# Altium schematic sheet POWER.SchDoc
size A3; SheetNumber: 3; SheetTotal: 7
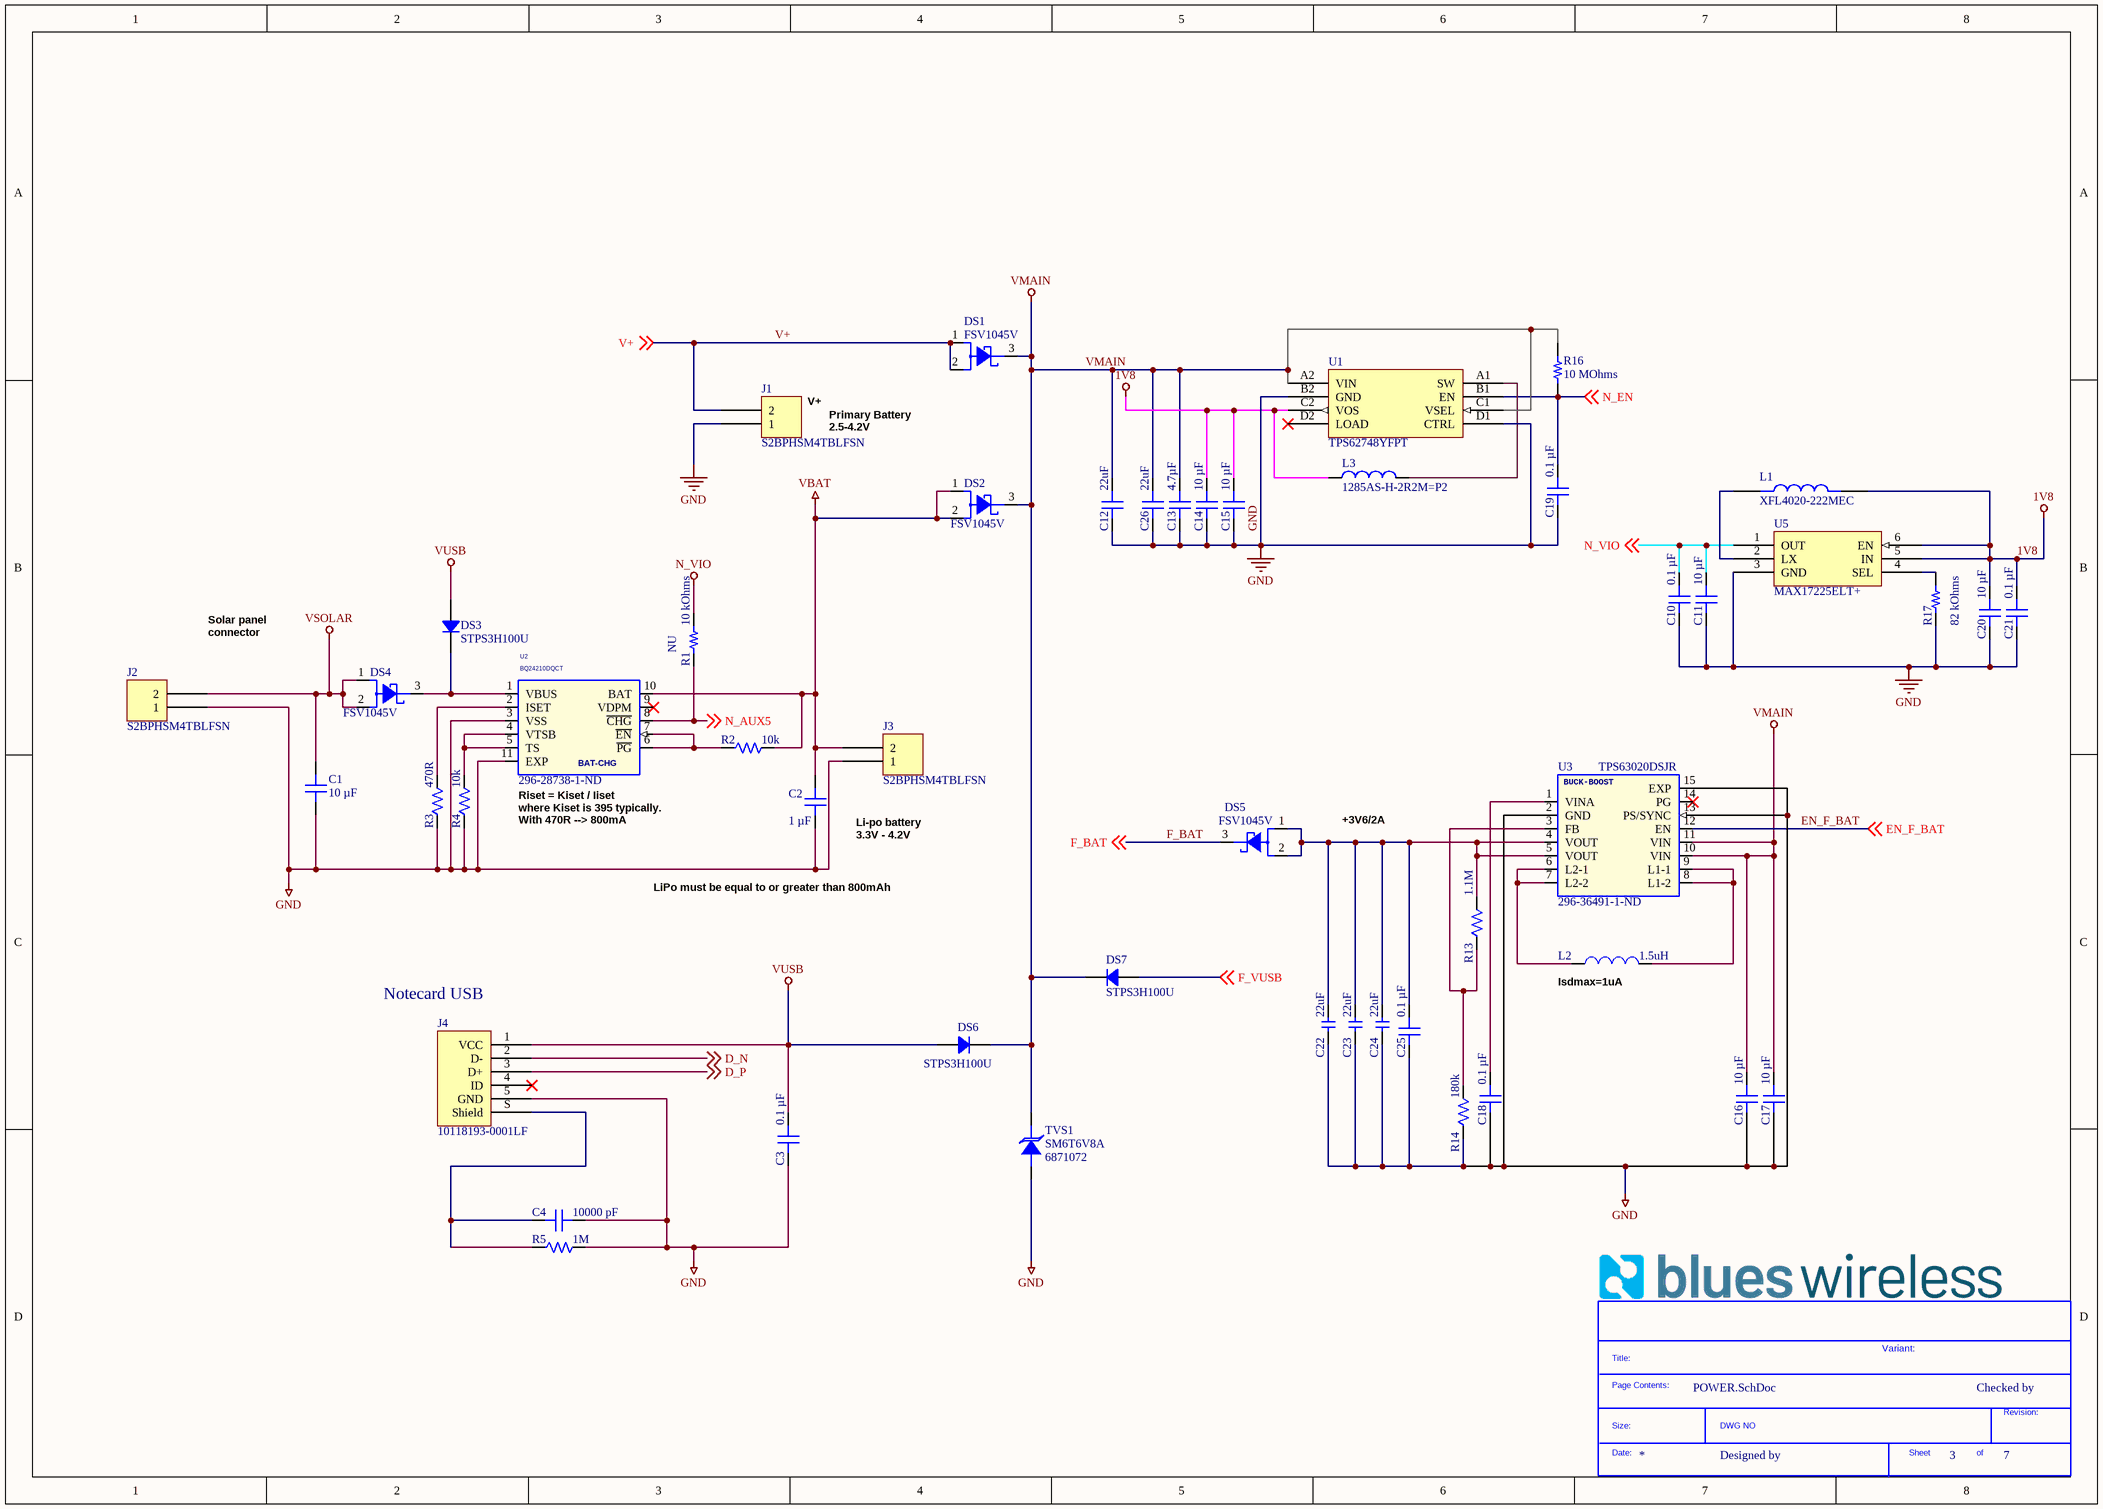
[diagram p0: POWER.SchDoc]

## Parts
*?  SDTitleBlock  (value not drawn)  (graphical)
C1  10 µF  [CAP 1206_3216 - 0.8MM]
C2  1 µF  [CAP 0402_1005]
C3  0.1 µF  [CAP 0402_1005]
C4  10000 pF  [CAP 1206_3216 - 0.8MM]
C10  0.1 µF  [CAP 0402_1005]
C11  10 µF  [CAP 0402_1005]
C12  22uF  [CAP 0805_2012]
C13  4.7µF  [CAP 0603_1608]
C14  10 µF  [CAP 0402_1005]
C15  10 µF  [CAP 0402_1005]
C16  10 µF  [CAP 0603_1608]
C17  10 µF  [CAP 0603_1608]
C18  0.1 µF  [CAP 0402_1005]
C19  0.1 µF  [CAP 0402_1005]
C20  10 µF  [CAP 0402_1005]
C21  0.1 µF  [CAP 0402_1005]
C22  22uF  [CAP FILM 0805]
C23  22uF  [CAP FILM 0805]
C24  22uF  [CAP FILM 0805]
C25  0.1 µF  [CAP 0402_1005]
C26  22uF  [CAP 0805_2012]
DS1  FSV1045V  [TO277-3]
DS2  FSV1045V  [TO277-3]
DS3  STPS3H100U  [DO214AA SMB]
DS4  FSV1045V  [TO277-3]
DS5  FSV1045V  [TO277-3]
DS6  STPS3H100U  [DO214AA SMB]
DS7  STPS3H100U  [DO214AA SMB]
J1  S2BPHSM4TBLFSN  [JST S2B-PH-SM4-TB]
J2  S2BPHSM4TBLFSN  [JST S2B-PH-SM4-TB]
J3  S2BPHSM4TBLFSN  [JST S2B-PH-SM4-TB]
J4  10118193-0001LF  [FCI USB 10118193-0001LF]
L1  XFL4020-222MEC  [IND_XFL4020-222MEC]
L2  1.5uH  [VCHA042A-1R5MS6]
L3  1285AS-H-2R2M=P2  [1285AS-H-2R2M=P2-INDC2016X100N]
R1  10 kOhms  [RES 0402_1005]  (no BOM)
R2  10k  [RES 0402_1005]
R3  470R  [RES 0402_1005]
R4  10k  [RES 0402_1005]
R5  1M  [RES 1206_3216]
R13  1.1M  [RES 0402_1005]
R14  180k  [RES 0402_1005]
R16  10 MOhms  [RES 0402_1005]
R17  82 kOhms  [RES 0402_1005]
TVS1  SM6T6V8A  Supplier Part Number 1: 6871072  [SMB]
U1  TPS62748YFPT  [TPS62748YFPT-DSBGA4x2]
U2  BQ24210DQCT  Supplier Part Number 1: 296-28738-1-ND  [WSON10-EXP]
U3  TPS63020DSJR  Supplier Part Number 1: 296-36491-1-ND  [TI PVSON-14 DSJ]
U5  MAX17225ELT+  [MAX17225ELT+UDFN]

## Nets
1V8: C14.2 C15.2 C20.2 C21.1 L1.2 L3.1 U1.C2(VOS) U5.5(IN) U5.6(EN)
GND: C1.2 C2.1 C3.2 C4.2 C10.2 C11.1 C12.1 C13.1 C14.1 C15.1 C16.1 C17.1 C18.1 C19.2 C20.1 C21.2 C22.2 C23.2 C24.2 C25.1 C26.1 J1.1 J2.1 J3.1 J4.5(GND) R3.1 R4.1 R5.2 R14.1 R17.1 TVS1.2(A) U1.B2(GND) U1.D1(CTRL) U2.3(VSS) U2.11(EXP) U3.2(GND) U3.13(PS/SYNC) U3.15(EXP) U5.3(GND)
N_VIO: C10.1 C11.2 R1.2 U5.1(OUT) ; off-sheet N_VIO
VBAT: C2.2 DS2.1(A1) DS2.2(A2) J3.2 R2.2 U2.10(BAT)
VMAIN: C12.2 C13.2 C16.2 C17.2 C26.2 DS1.3(C) DS2.3(C) DS6.2 DS7.2 R16.2 TVS1.1(C) U1.A2(VIN) U1.C1(VSEL) U3.10(VIN) U3.11(VIN)
VSOLAR: C1.1 DS4.1(A1) DS4.2(A2) J2.2
VUSB: C3.1 DS3.1 DS6.1 J4.1(VCC)
D_N: J4.2(D-) ; off-sheet D_N
D_P: J4.3(D+) ; off-sheet D_P
EN_F_BAT: U3.12(EN) ; off-sheet EN_F_BAT
F_BAT: DS5.3(C) ; off-sheet F_BAT
F_VUSB: DS7.1 ; off-sheet F_VUSB
N_AUX5: R1.1 U2.8(~{CHG}) ; off-sheet N_AUX5
N_EN: C19.1 R16.1 U1.B1(EN) ; off-sheet N_EN
V+: DS1.1(A1) DS1.2(A2) J1.2 ; off-sheet V+
NetC4_1: C4.1 J4.S(Shield) R5.1
NetC18_2: C18.2 U3.1(VINA)
NetC22_1: C22.1 C23.1 C24.1 C25.2 DS5.1(A1) DS5.2(A2) R13.2 U3.4(VOUT) U3.5(VOUT)
NetDS3_2: DS3.2 DS4.3(C) U2.1(VBUS)
NetL1_1: L1.1 U5.2(LX)
NetL2_1: L2.1(C) U3.6(L2-1) U3.7(L2-2)
NetL2_2: L2.2(A) U3.8(L1-2) U3.9(L1-1)
NetL3_2: L3.2 U1.A1(SW)
NetR2_1: R2.1 U2.6(~{PG}) U2.7(~{EN})
NetR3_2: R3.2 U2.2(ISET)
NetR4_2: R4.2 U2.4(VTSB) U2.5(TS)
NetR13_1: R13.1 R14.2 U3.3(FB)
NetR17_2: R17.2 U5.4(SEL)

Not connected (* = marked no-connect by the designer): J4 4(ID)*; U1 D2(LOAD)*; U2 9(VDPM)*; U3 14(PG)*

## Notes on the sheet
- (near J1) V+
- Primary Battery
  2.5-4.2V
- Solar panel
  connector
- (near R1) NU
- Riset = Kiset / Iiset
  where Kiset is 395 typically.
  With 470R --> 800mA
- Li-po battery
  3.3V - 4.2V
- +3V6/2A
- LiPo must be equal to or greater than 800mAh
- (near L2) Isdmax=1uA
- (near J4) Notecard USB
- Variant:
- Checked by
- Designed by
- (in symbol BAT-CHARGE - BQ24210DQCT) BAT-CHG
- (in symbol SDTitleBlock) Title:; Page Contents:; Revision:; Size:; DWG NO; Date:; Sheet; of

## Library data of the parts
C1 = CL31A106KAHNNNE: CAP CER 10UF 25V X5R 1206; manufacturer: Samsung Electro-Mechanics; Tolerance: ±10%; Part Number: CL31A106KAHNNNE; Value: 10 µF; Applications: General Purpose; Capacitance: 10 µF; componentlink1description: Datasheet; componentlink1url: http://www.samsungsem.com/kr/support/product-search/mlcc/CL31A106KAHNNNE.jsp; componentlink2description: DigiKey Link; componentlink2url: https://www.digikey.com/en/products/detail/samsung-electro-mechanics/CL31A106KAHNNNE/3886733; Device Package: 1206 (3216 Metric); lastupdated: 3/13/2022 5:23:44 AM; Lifecycle Status: Active; Minimum Order: 1; Mounting Type: Surface Mount, MLCC; Operating Temperature: -55°C ~ 85°C; Package / Case: 1206 (3216 Metric); packaging: TapeAndReel; partid: 21774; Part Status: Active; price: 0.03; series: CL; Size / Dimension: 0.126" L x 0.063" W (3.20mm x 1.60mm); Supplier 1: DigiKey; Supplier Part Number 1: 1276-1075-1-ND; Temperature Coefficient: X5R; Thickness (Max): 0.071" (1.80mm); Voltage - Rated: 25V
C2 = CL05A105KO5NNNC: CAP CER 1UF 16V X5R 0402; manufacturer: Samsung Electro-Mechanics; Tolerance: ±10%; Part Number: CL05A105KO5NNNC; Value: 1 µF; Applications: General Purpose; Capacitance: 1 µF; componentlink1description: Datasheet; componentlink1url: http://www.samsungsem.com/kr/support/product-search/mlcc/CL05A105KO5NNNC.jsp; componentlink2description: DigiKey Link; componentlink2url: https://www.digikey.com/en/products/detail/samsung-electro-mechanics/CL05A105KO5NNNC/3886725; Device Package: 0402 (1005 Metric); lastupdated: 3/13/2022 5:15:31 AM; Lifecycle Status: Active; Minimum Order: 1; Mounting Type: Surface Mount, MLCC; Operating Temperature: -55°C ~ 85°C; Package / Case: 0402 (1005 Metric); packaging: TapeAndReel; partid: 3120; Part Status: Active; price: 0.01; series: CL; Size / Dimension: 0.039" L x 0.020" W (1.00mm x 0.50mm); Supplier 1: DigiKey; Supplier Part Number 1: 1276-1067-1-ND; Temperature Coefficient: X5R; Thickness (Max): 0.022" (0.55mm); Voltage - Rated: 16V
C3 C10 C18 C19 C21 C25 = CL05B104KO5NNNC: CAP CER 0.1UF 16V X7R 0402; manufacturer: Samsung Electro-Mechanics; Tolerance: ±10%; Part Number: CL05B104KO5NNNC; Value: 0.1 µF; Applications: General Purpose; Capacitance: 0.1 µF; componentlink1description: Datasheet; componentlink1url: http://www.samsungsem.com/kr/support/product-search/mlcc/CL05B104KO5NNNC.jsp; componentlink2description: DigiKey Link; componentlink2url: https://www.digikey.com/en/products/detail/samsung-electro-mechanics/CL05B104KO5NNNC/3886659; Device Package: 0402 (1005 Metric); lastupdated: 3/13/2022 5:15:23 AM; Lifecycle Status: Active; Minimum Order: 1; Mounting Type: Surface Mount, MLCC; Operating Temperature: -55°C ~ 125°C; Package / Case: 0402 (1005 Metric); packaging: CutTape; partid: 6066; Part Status: Active; price: 0.01; series: CL; Size / Dimension: 0.039" L x 0.020" W (1.00mm x 0.50mm); Supplier 1: DigiKey; Supplier Part Number 1: 1276-1001-1-ND; Temperature Coefficient: X7R; Thickness (Max): 0.022" (0.55mm); Voltage - Rated: 16V
C4 = CS1206KKX7RCBB103: CAP CER 10000PF 1KV X7R 1206; manufacturer: Yageo; Tolerance: ±10%; Voltage - Rated: 1000V (1kV); Part Number: CS1206KKX7RCBB103; Value: 10000 pF; Applications: Boardflex Sensitive; Capacitance: 10000 pF; componentlink1description: Datasheet; componentlink1url: http://www.yageo.com/NewPortal/yageodocoutput?fileName=/pdf/MLCC/UPY-ST_NPOX7R_16V-to-3KV_5.pdf; componentlink2description: DigiKey Link; componentlink2url: https://www.digikey.com/en/products/detail/yageo/CS1206KKX7RCBB103/6098026; Device Package: 1206 (3216 Metric); Features: Soft Termination; lastupdated: 3/13/2022 5:23:50 AM; Lifecycle Status: Active; Minimum Order: 1; Mounting Type: Surface Mount, MLCC; Operating Temperature: -55°C ~ 125°C; Package / Case: 1206 (3216 Metric); packaging: TapeAndReel; partid: 21090; Part Status: Active; price: 0.08; series: CS; Size / Dimension: 0.126" L x 0.063" W (3.20mm x 1.60mm); Supplier 1: DigiKey; Supplier Part Number 1: 311-3578-1-ND; Temperature Coefficient: X7R; Thickness (Max): 0.057" (1.45mm)
C11 C14 C15 C20 = GRJ155R60J106ME11D: CAP CER 10UF 6.3V X5R 0402; manufacturer: Murata Electronics; Tolerance: ±20%; Part Number: GRJ155R60J106ME11D; Value: 10 µF; Applications: Boardflex Sensitive; Capacitance: 10 µF; componentlink1description: Datasheet; componentlink1url: https://psearch.en.murata.com/capacitor/product/GRJ155R60J106ME11%23.pdf; componentlink2description: DigiKey Link; componentlink2url: https://www.digikey.com/en/products/detail/murata-electronics/GRJ155R60J106ME11D/5877374; Device Package: 0402 (1005 Metric); Features: Soft Termination; lastupdated: 3/13/2022 5:15:21 AM; Lifecycle Status: Active; Minimum Order: 1; Mounting Type: Surface Mount, MLCC; Operating Temperature: -55°C ~ 85°C; Package / Case: 0402 (1005 Metric); packaging: TapeAndReel; partid: 6740; Part Status: Active; price: 0.02; series: GRJ; Size / Dimension: 0.039" L x 0.020" W (1.00mm x 0.50mm); Supplier 1: DigiKey; Supplier Part Number 1: 490-13211-1-ND; Temperature Coefficient: X5R; Thickness (Max): 0.028" (0.70mm); Voltage - Rated: 6.3V
C12 C26 = CL21A226MOQNNNE DVT: Cap Ceramic 22uF 16V X5R 20% Pad SMD 0805 85°C T/R; Manufacturer 1: Samsung; Supplier 1: Avnet; Manufacturer Part Number 1: CL21A226MOQNNNE; RoHS: Yes; Category: Ceramic Capacitors; Stock 1: 660000; Pricing 1: 2000=0.04698, 4000=0.04590, 8000=0.04482, 12000=0.04374, 16000=0.04266 (USD); Mount: Surface Mount; Case/Package: 0805; Case Code (Metric): 2012; Case Code (Imperial): 0805; Contact Plating: Tin; Min Operating Temperature: -55°C; Max Operating Temperature: 85°C; Package Quantity: 1; Packaging: Cut Tape; Capacitance: 22uF; Tolerance: 20%; Voltage Rating: 16V; Dielectric: X5R; Voltage Rating (DC): 16V; Termination: Wraparound; Series: CL; Construction: Flat; Length: 0.079inch; Width: 0.049inch; Thickness: 0.055inch; RoHS Compliant: Yes; Lead Free: Lead Free; ComponentLink1URL: https://datasheet.ciiva.com/25724/cl21a226moqnnne-25724832.pdf?src-supplier=Digi-Key; ComponentLink1Description: https://datasheet.ciiva.com/25724/cl21a226moqnnne-25724832.pdf?src-supplier=Digi-Key; Supplier Part Number 1: CL21A226MOQNNNE
C13 = 06036D475KAT4A: CAP CER 4.7UF 6.3V X5R 0603; manufacturer: AVX Corporation; Tolerance: ±10%; Part Number: 06036D475KAT4A; Value: 4.7µF; Applications: General Purpose; Capacitance: 4.7µF; componentlink1description: Datasheet; componentlink1url: http://datasheets.avx.com/cx5r.pdf; componentlink2description: DigiKey Link; componentlink2url: http://digikey.com/product-detail/en/avx-corporation/06036D475KAT4A/478-10813-1-ND/7536337; Device Package: 0603 (1608 Metric); lastupdated: 9/2/2020 1:03:34 AM; Lifecycle Status: Active; Minimum Order: 1; Mounting Type: Surface Mount, MLCC; Operating Temperature: -55°C ~ 85°C; Package / Case: 0603 (1608 Metric); packaging: TapeAndReel; partid: 2929; Part Status: Active; price: 0.02; series: -; Size / Dimension: 0.063" L x 0.032" W (1.60mm x 0.81mm); Supplier 1: DigiKey; Supplier Part Number 1: 478-10813-1-ND; Temperature Coefficient: X5R; Thickness (Max): 0.037" (0.94mm); Voltage - Rated: 6.3V
C16 C17 = CL10A106KP8NNNC: CAP CER 10UF 10V X5R 0603; manufacturer: Samsung Electro-Mechanics; Tolerance: ±10%; Part Number: CL10A106KP8NNNC; Value: 10 µF; Applications: General Purpose; Capacitance: 10 µF; componentlink1description: Datasheet; componentlink1url: http://www.samsungsem.com/kr/support/product-search/mlcc/CL10A106KP8NNNC.jsp; componentlink2description: DigiKey Link; componentlink2url: https://www.digikey.com/en/products/detail/samsung-electro-mechanics/CL10A106KP8NNNC/3886850; Device Package: 0603 (1608 Metric); lastupdated: 3/13/2022 5:18:34 AM; Lifecycle Status: Active; Minimum Order: 1; Mounting Type: Surface Mount, MLCC; Operating Temperature: -55°C ~ 85°C; Package / Case: 0603 (1608 Metric); packaging: TapeAndReel; partid: 12919; Part Status: Active; price: 0.02; series: CL; Size / Dimension: 0.063" L x 0.031" W (1.60mm x 0.80mm); Supplier 1: DigiKey; Supplier Part Number 1: 1276-1192-1-ND; Temperature Coefficient: X5R; Thickness (Max): 0.035" (0.90mm); Voltage - Rated: 10V
C22-C24 = CL21A226MOQNNNE: 贴片电容（MLCC） 22µF ±20% 16V X5R 0805; Manufacturer: Samsung; Supplier 1: Avnet; Manufacturer Part Number: CL21A226MOQNNNE; RoHS: Yes; Category: Ceramic Capacitors; Stock 1: 752000; Pricing 1: 2000=0.03780, 4000=0.03726, 8000=0.03618, 12000=0.03537, 16000=0.03402 (USD); Mount: Surface Mount; Case/Package: 0805; Case Code (Metric): 2012; Case Code (Imperial): 0805; Contact Plating: Tin; Min Operating Temperature: -55°C; Max Operating Temperature: 85°C; Package Quantity: 1; Packaging: Cut Tape; Tolerance: 20%; Voltage Rating: 16V; Dielectric: X5R; Voltage Rating (DC): 16V; Termination: Wraparound; Series: CL; Construction: Flat; Length: 0.079inch; Width: 0.049inch; Thickness: 0.055inch; RoHS Compliant: Yes; Lead Free: Lead Free; ComponentLink1URL: https://datasheet.ciiva.com/25724/cl21a226moqnnne-25724832.pdf?src-supplier=Digi-Key; ComponentLink1Description: https://datasheet.ciiva.com/25724/cl21a226moqnnne-25724832.pdf?src-supplier=Digi-Key; Supplier Part Number 1: CL21A226MOQNNNE; Capacitance: 22uF
DS1 DS2 DS4 DS5 = SCHOTTKY - FSV1045V - 10A/45V: DIODO SCHOTTKY 10A 45V FSV1045V TO277-3 SMT; Temp Range: -55°..+150°; ROOM: SOLAR BATTERY CHARGER; Pkg Type: SMD; Database: 42269; MPN: FSV1045V; Price Distributor Cad: 0,629; Modello: SCHOTTKY; Famiglia: DIODO; Distributor: FAE; Caratteristiche: 10A/45V; PCB Footprint: TO277-3; Supplier 1: Digi-Key; Supplier Part Number 1: FSV1045VCT-ND
DS3 DS6 DS7 = STPS3H100U: DIODE SCHOTTKY 100V 3A SMB; Manufacturer: STMicroelectronics; Current - Reverse Leakage @ Vr: 1 µA @ 100 V; Speed: Fast Recovery =< 500ns, > 200mA (Io); Voltage - Forward (Vf) (Max) @ If: 840 mV @ 3 A; Part Number: STPS3H100U; ComponentLink1Description: Datasheet; ComponentLink1URL: //media.digikey.com/pdf/Data%20Sheets/ST%20Microelectronics%20PDFS/STPS3H100.pdf; ComponentLink2Description: DigiKey Link; ComponentLink2URL: https://www.digikey.com/en/products/detail/stmicroelectronics/STPS3H100U/2236916; Current - Average Rectified (Io): 3A; Diode Type: Schottky; LastUpdated: 5/12/2022 2:47:56 PM; Lifecycle Status: Active; Minimum Order: 1; Mounting Type: Surface Mount; Operating Temperature - Junction: 175°C (Max); Package / Case: DO-214AA, SMB; Packaging: TapeAndReel; PartId: 1551; Part Status: Active; Price: 0.29; Series: -; Supplier 1: DigiKey; Supplier Part Number 1: 497-10392-1-ND; Supplier Device Package: SMB; Voltage - DC Reverse (Vr) (Max): 100 V
J1-J3 = S2BPHSM4TBLFSN: PH SMT SIDE ENTRY HDR 2W; Manufacturer: JST; Current Rating: 2A; Voltage Rating (AC): 100V; Number of Poles: 2; Contact Resistance: 20mR; Insulation Resistance: 1GR; Gender: Male; Connector Type: Header; Pitch: 2mm; Supplier 1: Digi-Key; Manufacturer Part Number: S2BPHSM4TBLFSN; RoHS: Yes; Category: Connectors; Mount: Surface Mount; Contact Plating: Tin,Copper; Contact Material: Copper Alloy,Bronze,Tin,Brass; Color: Natural,White; Housing Color: Beige; Housing Material: Polyamide; Contact Shape: Square; Insulation Material: Nylon; Insulation Color: Natural; Contact Finish - Mating: TIN; Min Operating Temperature: -25°C; Max Operating Temperature: 85°C; Number of Rows: 1; Voltage Rating: 100V; Packaging: Tape and Reel; Max Current Rating: 2A; Number of Positions: 2; Termination: Solder; Fastening Type: Detent; Number of Contacts: 2; Working Voltage: 100V; Max Voltage Rating (AC): 100V; Max Voltage Rating (DC): 100V; Orientation: Right Angle; Series: PH; Contact Type: Male Pin; Length: 7.9mm; Width: 5mm; Height: 9.4mm; Lead Pitch: 2mm; Contact Mating Length: 0.13inch; Depth: 7.6mm; REACH SVHC: No SVHC; Lead Free: Lead Free; Flammability Rating: UL94 V-0; ComponentLink1URL: https://datasheet.ciiva.com/712/eph-712514.pdf?src-supplier=Digi-Key; ComponentLink1Description: https://datasheet.ciiva.com/712/eph-712514.pdf?src-supplier=Digi-Key; Supplier Part Number 1: 455-1749-1-ND
J4 = USB 2.0 Type B Micro: CONN RCPT USB2.0 MICRO B SMD R/A; Manufacturer 1: Amphenol ICC (FCI); Connector Type: USB - micro B; Current Rating (Amps): 1.8A per Contact; Gender: Receptacle; Mating Cycles: 10000; Number of Contacts: 5; Number of Ports: 1; Shielding: Shielded; Voltage - Rated: 100VAC; Manufacturer Part Number 1: 10118193-0001LF; ComponentLink1Description: Datasheet; ComponentLink1URL: https://cdn.amphenol-icc.com/media/wysiwyg/files/documentation/datasheet/inputoutput/io_usb_micro.pdf; ComponentLink2Description: DigiKey Link; ComponentLink2URL: //digikey.com/product-detail/en/amphenol-icc-fci/10118193-0001LF/609-4616-2-ND/2785388; Features: Solder Retention; LastUpdated: 12/9/2019 8:51:28 PM; Lifecycle Status: 0; Minimum Order: 1; Mounting Feature: Horizontal; Mounting Type: Surface Mount, Right Angle; Through Hole; Operating Temperature: -30°C ~ 80°C; Packaging: TapeAndReel; Part Status: Active; Price: 0.21; Series: -; Specifications: USB 2.0; Supplier 1: DigiKey; Supplier Part Number 1: 609-4616-2-ND; Termination: Solder
L1 = XFL4020-222MEC: Power inductor, shielded, 20% tol, SMT, RoHS, halogen free; Manufacturer 1: Coilcraft; MF: {'manufacturer': u'Coilcraft'}; Value: *; Manufacturer Part Number 1: XFL4020-222MEC; Package: None; Price: None; Availability: Unavailable
L2 = VCHA042A-1R5MS6: Fixed Ind 1.5UH 7.3A 15.4 Mohm; Manufacturer: Cyntec; Supplier 1: Digi-Key; Manufacturer Part Number: VCHA042A-1R5MS6; RoHS: Yes; Category: Fixed Inductors; Stock 1: 1541; Pricing 1: 1=1.40000, 10=1.29600, 25=1.19640, 50=0.99680, 100=0.93710, 250=0.83736, 500=0.71776, 1000=0.63800 (USD); Supplier Part Number 1: 2037-VCHA042A-1R5MS6CT-ND
L3 = 1285AS-H-2R2M=P2: Inductor Power Shielded Wirewound 2.2uH 20% 1MHz Metal 1.2A 0.204Ohm DCR 0806 T/R; Manufacturer: Murata; Core Material: Ferrite; DC Resistance (DCR): 204mR; Current Rating: 1.5A; Supplier 1: Digi-Key; Manufacturer Part Number: 1285AS-H-2R2M=P2; RoHS: Yes; Category: Fixed Inductors; Stock 1: 2212; Pricing 1: 1=0.40000, 10=0.35300, 25=0.30920, 50=0.26500, 100=0.24280, 250=0.22076, 500=0.20752, 1000=0.15895 (USD); Mount: Surface Mount; Case/Package: 0805; Case Code (Metric): 2012; Case Code (Imperial): 0805; Min Operating Temperature: -40°C; Max Operating Temperature: 85°C; Inductance: 2.2uH; Shielding: Shielded; Max DC Current: 1.2A; Tolerance: 20%; Packaging: Tape and Reel; Resistor Type: Wirewound,Metal Alloy; Test Frequency: 1MHz; Length: 0.079inch; Width: 0.063inch; Depth: 1.6mm; Height - Seated (Max): 0.039inch; RoHS Compliant: Yes; ComponentLink1URL: http://www.toko.co.jp/products/pdf/inductors/dfe201610c.pdf?src-supplier=Avnet; ComponentLink1Description: http://www.toko.co.jp/products/pdf/inductors/dfe201610c.pdf?src-supplier=Avnet; ComponentLink2URL: https://www.murata.com/~/media/webrenewal/products/inductor/chip/tokoproducts/wirewoundmetalalloychiptype/m_dfe201610c.ashx?src-supplier=Digi-Key; ComponentLink2Description: https://www.murata.com/~/media/webrenewal/products/inductor/chip/tokoproducts/wirewoundmetalalloychiptype/m_dfe201610c.ashx?src-supplier=Digi-Key; Supplier Part Number 1: 490-10600-1-ND
R1 = CRGP0402F10K: RES 10K OHM 1% 1/8W 0402; Manufacturer: TE Connectivity Passive Product; Power (Watts): 0.125W, 1/8W; Temperature Coefficient: ±100ppm/°C; Part Number: CRGP0402F10K; Value: 10 kOhms; ComponentLink1Description: Datasheet; ComponentLink1URL: https://www.te.com/commerce/DocumentDelivery/DDEController?Action=srchrtrv&DocNm=9-1773463-9&DocType=DS&DocLang=English; ComponentLink2Description: DigiKey Link; ComponentLink2URL: https://www.digikey.com/en/products/detail/te-connectivity-passive-product/CRGP0402F10K/8576969; Composition: Thick Film; Device Package: 0402 (1005 Metric); Features: Pulse Withstanding; Height - Seated (Max): 0.016" (0.40mm); LastUpdated: 3/13/2022 5:31:04 AM; Lifecycle Status: Active; Minimum Order: 1; Number of Terminations: 2; Operating Temperature: -55°C ~ 155°C; Package / Case: 0402 (1005 Metric); Packaging: TapeAndReel; PartId: 6238; Part Status: Active; Price: 0.01; Resistance: 10 kOhms; Series: CRGP; Size / Dimension: 0.043" L x 0.020" W (1.10mm x 0.50mm); Supplier 1: DigiKey; Supplier Part Number 1: A130367CT-ND; Supplier Device Package: 0402; Tolerance: ±1%
R2 R4 = RC1005F103CS: Res Thick Film 0402 10K Ohm 1% 1/16W ±100ppm/°C Molded SMD SMD T/R; Manufacturer: Samsung; Resistance: 10kR; Power Rating: 63mW; Supplier 1: Digi-Key; Manufacturer Part Number: RC1005F103CS; RoHS: Yes; Category: Chip SMD Resistors; Stock 1: 58620569; Pricing 1: 10000=0.00695 (USD); Mount: Surface Mount; Case/Package: 0402; Case Code (Metric): 1005; Case Code (Imperial): 0402; Contact Plating: Tin; Size Code: 0402; Min Operating Temperature: -55°C; Max Operating Temperature: 155°C; Tolerance: 1%; Packaging: Tape and Reel; Resistor Type: Thick Film; Package Quantity: 1; Number of Terminations: 2; Max Power Dissipation: 63mW; Temperature Coefficient: 100ppm/°C; Features: Moisture Resistant; Series: RC; Construction: Rectangular; Length: 0.039inch; Width: 0.02inch; Height: 0.016inch; Depth: 0.5mm; Radiation Hardening: No; Military Standard: Not; RoHS Compliant: Yes; ComponentLink1URL: https://datasheet.ciiva.com/15196/getdatasheetpartid-504789-15196214.pdf?src-supplier=Verical; ComponentLink1Description: https://datasheet.ciiva.com/15196/getdatasheetpartid-504789-15196214.pdf?src-supplier=Verical; ComponentLink2URL: https://datasheet.ciiva.com/16481/rcseries-16481007.pdf?src-supplier=Future+Electronics; ComponentLink2Description: https://datasheet.ciiva.com/16481/rcseries-16481007.pdf?src-supplier=Future+Electronics; Supplier Part Number 1: 1276-3431-2-ND
R3 = RC0402FR-07470RL: Res Thick Film 0402 470 Ohm 1% 0.063W(1/16W) ±100ppm/C Pad SMD T/R; Manufacturer: Yageo; Voltage Rating: 50V; Power Rating: 62.5mW; Max Power Dissipation: 63mW; Temperature Coefficient: 100ppm/°C; Supplier 1: Digi-Key; Manufacturer Part Number: RC0402FR-07470RL; RoHS: Yes; Category: Chip SMD Resistors; Stock 1: 4221525; Pricing 1: 10000=0.00186 (USD); Case/Package: 0402; Case Code (Metric): 1005; Case Code (Imperial): 0402; Size Code: 0402; Min Operating Temperature: -55°C; Max Operating Temperature: 155°C; Packaging: Tape and Reel; Resistance: 470R; Tolerance: 1%; Package Quantity: 1; Resistor Type: Thick Film; Number of Terminations: 2; Termination: SMD/SMT; Features: Moisture Resistant; Series: RC; Resistance Tolerance: 1%; Construction: Rectangular; Length: 1mm; Width: 0.02inch; Height: 0.016inch; Depth: 0.5mm; RoHS Compliant: Yes; REACH SVHC: Unknown; Military Standard: Not; Lead Free: Lead Free; ComponentLink1URL: https://datasheet.ciiva.com/2453/pyu-r-int-thick-7-2453376.pdf?src-supplier=Digi-Key; ComponentLink1Description: https://datasheet.ciiva.com/2453/pyu-r-int-thick-7-2453376.pdf?src-supplier=Digi-Key; ComponentLink2URL: https://datasheet.ciiva.com/2453/pyu-r-int-thick-7-2453377.pdf?src-supplier=Digi-Key; ComponentLink2Description: https://datasheet.ciiva.com/2453/pyu-r-int-thick-7-2453377.pdf?src-supplier=Digi-Key; ComponentLink3URL: https://datasheet.ciiva.com/2453/pyu-r-int-thick-7-2453378.pdf?src-supplier=Digi-Key; ComponentLink3Description: https://datasheet.ciiva.com/2453/pyu-r-int-thick-7-2453378.pdf?src-supplier=Digi-Key; ComponentLink4URL: https://datasheet.ciiva.com/15189/getdatasheetpartid-330246-15189463.pdf?src-supplier=Verical; ComponentLink4Description: https://datasheet.ciiva.com/15189/getdatasheetpartid-330246-15189463.pdf?src-supplier=Verical; ComponentLink5URL: https://datasheet.ciiva.com/46412/1018594-46412838.pdf?src-supplier=Element14; ComponentLink5Description: https://datasheet.ciiva.com/46412/1018594-46412838.pdf?src-supplier=Element14; ComponentLink6URL: https://datasheet.ciiva.com/7850/1018594-7850014.pdf?src-supplier=Element14; ComponentLink6Description: https://datasheet.ciiva.com/7850/1018594-7850014.pdf?src-supplier=Element14; ComponentLink7URL: https://datasheet.ciiva.com/7850/1018594-7850015.pdf?src-supplier=Element14; ComponentLink7Description: https://datasheet.ciiva.com/7850/1018594-7850015.pdf?src-supplier=Element14; Supplier Part Number 1: 311-470LRTR-ND
R5 = RC1206FR-071ML: Res Thick Film 1206 1M Ohm 1% 0.25W(1/4W) ±100ppm/C Pad SMD T/R; Manufacturer: Yageo; Resistance: 1MR; Temperature Coefficient: 100ppm/°C; Power Rating: 250mW; Voltage Rating: 200V; Supplier 1: Digi-Key; Manufacturer Part Number: RC1206FR-071ML; RoHS: Yes; Category: Chip SMD Resistors; Stock 1: 1941274; Pricing 1: 5000=0.00970 (USD); Case/Package: 1206; Case Code (Imperial): 1206; Case Code (Metric): 3216; Size Code: 1206; Min Operating Temperature: -55°C; Max Operating Temperature: 155°C; Tolerance: 1%; Resistor Type: Thick Film; Packaging: Tape and Reel; Package Quantity: 5000; Termination: SMD/SMT; Features: Moisture Resistant; Series: RC; Max Power Dissipation: 250mW; Number of Terminations: 2; Technology: THICK FILM; Resistance Tolerance: 1%; Construction: Rectangular; Length: 3.1mm; Width: 1.6mm; Height: 0.55mm; Depth: 1.6mm; REACH SVHC: Unknown; Lead Free: Lead Free; Military Standard: Not; RoHS Compliant: Yes; ComponentLink1URL: https://datasheet.ciiva.com/11819/0900766b80c6630a-11819912.pdf?src-supplier=RSComponents; ComponentLink1Description: https://datasheet.ciiva.com/11819/0900766b80c6630a-11819912.pdf?src-supplier=RSComponents; ComponentLink2URL: https://datasheet.ciiva.com/17033/pyu-rc1206-51-rohs-l-4-17033611.pdf?src-supplier=Future+Electronics; ComponentLink2Description: https://datasheet.ciiva.com/17033/pyu-rc1206-51-rohs-l-4-17033611.pdf?src-supplier=Future+Electronics; ComponentLink3URL: https://datasheet.ciiva.com/7857/444357-7857288.pdf?src-supplier=Element14; ComponentLink3Description: https://datasheet.ciiva.com/7857/444357-7857288.pdf?src-supplier=Element14; ComponentLink4URL: https://datasheet.ciiva.com/7857/444357-7857289.pdf?src-supplier=Element14; ComponentLink4Description: https://datasheet.ciiva.com/7857/444357-7857289.pdf?src-supplier=Element14; ComponentLink5URL: https://datasheet.ciiva.com/46445/444357-46445709.pdf?src-supplier=Element14; ComponentLink5Description: https://datasheet.ciiva.com/46445/444357-46445709.pdf?src-supplier=Element14; Supplier Part Number 1: 311-1.00MFRTR-ND
R13 = AC0402FR-071M1L: Res Thick Film 0402 1.1M Ohm 1% 0.063W(1/16W) ±100ppm/C Pad SMD Automotive T/R; Manufacturer: Yageo; Power Rating: 62.5mW; Resistance: 1.1MR; Voltage Rating: 50V; Temperature Coefficient: 100ppm/°C; Max Power Dissipation: 63mW; Supplier 1: Digi-Key; Manufacturer Part Number: AC0402FR-071M1L; RoHS: Yes; Category: Chip SMD Resistors; Stock 1: 15284; Pricing 1: 1=0.10000, 10=0.02200, 100=0.00900, 1000=0.00402, 2500=0.00349, 5000=0.00288 (USD); Case/Package: 0402; Case Code (Imperial): 0402; Case Code (Metric): 1005; Min Operating Temperature: -55°C; Max Operating Temperature: 155°C; Packaging: Tape and Reel; Tolerance: 1%; Resistor Type: Thick Film; Termination: SMD/SMT; Number of Terminations: 2; Features: Moisture Resistant,Automotive AEC-Q200; Series: AC; Length: 0.039inch; Width: 0.5mm; Height: 0.015inch; RoHS Compliant: Yes; ComponentLink1URL: http://www.mouser.com/ds/2/447/yageodocoutput-1111992.pdf?src-supplier=Mouser; ComponentLink1Description: http://www.mouser.com/ds/2/447/yageodocoutput-1111992.pdf?src-supplier=Mouser; ComponentLink2URL: http://www.yageo.com/NewPortal/yageodocoutput?fileName=/pdf/R-Chip/PYu-AC_51_RoHS_L_6.pdf&src-supplier=Digi-Key; ComponentLink2Description: http://www.yageo.com/NewPortal/yageodocoutput?fileName=/pdf/R-Chip/PYu-AC_51_RoHS_L_6.pdf&src-supplier=Digi-Key; Supplier Part Number 1: YAG5647CT-ND
R14 = RC0402FR-07180KL: Res Thick Film 0402 180K Ohm 1% 1/16W +/-100ppm/ßC Molded SMD Paper T/R; Manufacturer: Yageo; Power Rating: 63mW; Temperature Coefficient: 100ppm/°C; Resistance: 180kR; Voltage Rating: 50V; Supplier 1: Digi-Key; Manufacturer Part Number: RC0402FR-07180KL; RoHS: Yes; Category: Chip SMD Resistors; Stock 1: 959378; Pricing 1: 10000=0.00186 (USD); Case/Package: 0402; Case Code (Imperial): 0402; Case Code (Metric): 1005; Size Code: 0402; Min Operating Temperature: -55°C; Max Operating Temperature: 155°C; Tolerance: 1%; Packaging: Tape and Reel; Termination: SMD/SMT; Resistor Type: Thick Film; Features: Moisture Resistant; Series: RC; Max Power Dissipation: 63mW; Number of Terminations: 2; Construction: Rectangular; Resistance Tolerance: 1%; Length: 1mm; Depth: 0.5mm; RoHS Compliant: Yes; REACH SVHC: Unknown; Military Standard: Not; Lead Free: Lead Free; ComponentLink1URL: https://datasheet.ciiva.com/12656/pyu-rc0402-51-rohs-l-6-r-12656911.pdf?src-supplier=Mouser; ComponentLink1Description: https://datasheet.ciiva.com/12656/pyu-rc0402-51-rohs-l-6-r-12656911.pdf?src-supplier=Mouser; ComponentLink2URL: https://datasheet.ciiva.com/17025/pyu-rc0402-51-rohs-l-6-r-17025693.pdf?src-supplier=Future+Electronics; ComponentLink2Description: https://datasheet.ciiva.com/17025/pyu-rc0402-51-rohs-l-6-r-17025693.pdf?src-supplier=Future+Electronics; ComponentLink3URL: https://datasheet.ciiva.com/7849/1018594-7849851.pdf?src-supplier=Element14; ComponentLink3Description: https://datasheet.ciiva.com/7849/1018594-7849851.pdf?src-supplier=Element14; ComponentLink4URL: https://datasheet.ciiva.com/7849/1018594-7849852.pdf?src-supplier=Element14; ComponentLink4Description: https://datasheet.ciiva.com/7849/1018594-7849852.pdf?src-supplier=Element14; ComponentLink5URL: https://datasheet.ciiva.com/7983/1018594-7983497.pdf?src-supplier=Element14; ComponentLink5Description: https://datasheet.ciiva.com/7983/1018594-7983497.pdf?src-supplier=Element14; Supplier Part Number 1: 311-180KLRTR-ND
R16 = RC0402JR-0710ML: RES 10M OHM 5% 1/16W 0402; Manufacturer: Yageo; Power (Watts): 0.063W, 1/16W; Temperature Coefficient: ±100ppm/°C; Part Number: RC0402JR-0710ML; Value: 10 MOhms; ComponentLink1Description: Datasheet; ComponentLink1URL: https://www.yageo.com/upload/media/product/productsearch/datasheet/rchip/PYu-RC_Group_51_RoHS_L_10.pdf; ComponentLink2Description: DigiKey Link; ComponentLink2URL: https://www.digikey.com/en/products/detail/yageo/RC0402JR-0710ML/2827649; Composition: Thick Film; Device Package: 0402 (1005 Metric); Features: Moisture Resistant; Height - Seated (Max): 0.016" (0.40mm); LastUpdated: 3/13/2022 5:31:07 AM; Lifecycle Status: Active; Minimum Order: 1; Number of Terminations: 2; Operating Temperature: -55°C ~ 155°C; Package / Case: 0402 (1005 Metric); Packaging: CutTape; PartId: 4818; Part Status: Active; Price: 0.01; Resistance: 10 MOhms; Series: RC_L; Size / Dimension: 0.039" L x 0.020" W (1.00mm x 0.50mm); Supplier 1: DigiKey; Supplier Part Number 1: 311-10MJRCT-ND; Supplier Device Package: 0402; Tolerance: ±5%
R17 = RMCF0402FT82K0: RES 82K OHM 1% 1/16W 0402; Manufacturer: Stackpole Electronics Inc; Power (Watts): 0.063W, 1/16W; Temperature Coefficient: ±100ppm/°C; Part Number: RMCF0402FT82K0; Value: 82 kOhms; ComponentLink1Description: Datasheet; ComponentLink1URL: https://www.seielect.com/catalog/sei-rmcf_rmcp.pdf; ComponentLink2Description: DigiKey Link; ComponentLink2URL: https://www.digikey.com/en/products/detail/stackpole-electronics-inc/RMCF0402FT82K0/1761664; Composition: Thick Film; Device Package: 0402 (1005 Metric); Features: Automotive AEC-Q200; Height - Seated (Max): 0.016" (0.40mm); LastUpdated: 3/13/2022 5:30:53 AM; Lifecycle Status: Active; Minimum Order: 1; Number of Terminations: 2; Operating Temperature: -55°C ~ 155°C; Package / Case: 0402 (1005 Metric); Packaging: CutTape; PartId: 9283; Part Status: Active; Price: 0.01; Ratings: AEC-Q200; Resistance: 82 kOhms; Series: RMCF; Size / Dimension: 0.039" L x 0.020" W (1.00mm x 0.50mm); Supplier 1: DigiKey; Supplier Part Number 1: RMCF0402FT82K0CT-ND; Supplier Device Package: 0402; Tolerance: ±1%
TVS1 = TVS-UNI - SM6T6V8A - 6.8V/600W: DIODO TVS TRANSIL UNIDIR. 600W 6.8V SM6T6V8A SMB SMT; Pkg Type: SMD; Database: 14165; Note: Unidirezionale; Caratteristiche: 57A/6.8V/600W; Famiglia: PROTEZIONE; ROOM: INPUT; Distributor: FAE; Price Distributor Cad: 0,0348; Modello: TVS; PCB Footprint: SMB; Supplier 1: RSComponents
U1 = TPS62748YFPT: Conv DC-DC 2.15V to 5.5V Step Down Single-Out 1.2V/1.8V 0.3A 8-Pin DSBGA T/R; Manufacturer: Texas Instruments; Number of Outputs: 1; Min Output Voltage: 1.8V; Output Current: 300mA; Switching Frequency: 1.2MHz; Synchronous Rectifier: Yes; Efficiency: 90%; Quiescent Current: 360nA; Output Voltage: 1.2V; Output Configuration: Positive; Supplier 1: TI store; Manufacturer Part Number: TPS62748YFPT; RoHS: Yes; Category: Power Supply Modules; Pricing 1: 1=1.24500, 100=1.02900, 250=0.73900, 1000=0.55600 (USD); Mount: Surface Mount; Number of Pins: 8; Min Operating Temperature: -40°C; Max Operating Temperature: 125°C; Packaging: Cut Tape; Min Input Voltage: 2.15V; Max Input Voltage: 5.5V; Max Output Voltage: 1.8V; Max Output Current: 300mA; Operating Supply Voltage: 5.5V; REACH SVHC: No SVHC; Lead Free: Lead Free; RoHS Compliant: Yes; ComponentLink1URL: http://www.ti.com/general/docs/lit/getliterature.tsp?genericPartNumber=TPS62748&&fileType=pdf&src-supplier=Element14; ComponentLink1Description: http://www.ti.com/general/docs/lit/getliterature.tsp?genericPartNumber=TPS62748&&fileType=pdf&src-supplier=Element14; ComponentLink2URL: http://www.ti.com/general/docs/lit/getliterature.tsp?genericPartNumber=TPS62748&&fileType=pdf&src-supplier=Farnell; ComponentLink2Description: http://www.ti.com/general/docs/lit/getliterature.tsp?genericPartNumber=TPS62748&&fileType=pdf&src-supplier=Farnell; ComponentLink3URL: http://www.ti.com/lit/ds/symlink/tps62748.pdf?src-supplier=Digi-Key; ComponentLink3Description: http://www.ti.com/lit/ds/symlink/tps62748.pdf?src-supplier=Digi-Key; ComponentLink4URL: http://www.ti.com/general/docs/suppproductinfo.tsp?distId=10&amp;gotoUrl=http%3A%2F%2Fwww.ti.com%2Flit%2Fgpn%2Ftps62748&src-supplier=Digi-Key; ComponentLink4Description: http://www.ti.com/general/docs/suppproductinfo.tsp?distId=10&amp;gotoUrl=http%3A%2F%2Fwww.ti.com%2Flit%2Fgpn%2Ftps62748&src-supplier=Digi-Key; ComponentLink5URL: http://www.ti.com/general/docs/lit/getliterature.tsp?genericPartNumber=TPS62748&&fileType=pdf&src-supplier=Avnet; ComponentLink5Description: http://www.ti.com/general/docs/lit/getliterature.tsp?genericPartNumber=TPS62748&&fileType=pdf&src-supplier=Avnet; Supplier Part Number 1: TPS62748YFPT
U2 = BAT-CHARGE - BQ24210DQCT: INTEGRATO BQ24210DQCT WSON10 TEXAS SMT; Caratteristiche: LITIO; Database: 47785; Modello: CARICABATTERIA; Note: Vin=20V - Ichg=800mA; Pkg Type: SMD; Temp Range: -40°..+85°; ROOM: SOLAR BATTERY CHARGER; Distributor: FAE; Famiglia: INTEGRATO; MPN: BQ24210DQCT; Price Distributor Cad: 1,2778; PCB Footprint: WSON10-EXP; Supplier 1: Digi-Key
U3 = BUCK-BOOST - TPS63020DSJR: I.C. DC/DC CONVERTER TPS63020DSJR TEXAS VSON14 SMT; Caratteristiche: ADJmA/ADJ; Database: 42016; Famiglia: INTEGRATO; Modello: BUCK; Note: VDD=1V8 - 5V5 - Fsw=2.4MHz - Isw=3.5A; Pkg Type: SMD; Temp Range: -40°..+85°; PCB Footprint: IC-TPS6302x; Distributor: FAE; MPN: TPS63020DSJR; Price Distributor Cad: 1,2277; ROOM: BUCK-BOOST; Supplier 1: Digi-Key
U5 = MAX17225ELT+: nanoPower Boost Converter that Extends Battery Life and Reduces Solution Size; Manufacturer: Maxim; Supplier 1: Digi-Key; Manufacturer Part Number: MAX17225ELT+; RoHS: Yes; Category: Power Supply Modules; Mount: Surface Mount; Number of Pins: 6; Packaging: Bulk; ComponentLink1URL: https://datasheets.maximintegrated.com/en/ds/MAX17220-MAX17225.pdf?src-supplier=Digi-Key; ComponentLink1Description: https://datasheets.maximintegrated.com/en/ds/MAX17220-MAX17225.pdf?src-supplier=Digi-Key; Supplier Part Number 1: MAX17225ELT+ -ND